# Altium schematic sheet PowerSupply.SchDoc
size A4; Author: Esteban Durán Madrid; CompanyName: Universidad de Santiago de Chile; Address1: Avenida Ecuador Nº 3519; Address2: Estación Central, Santiago; Address3: Chile; DocumentNumber: 2; SheetNumber: 2; SheetTotal: 3
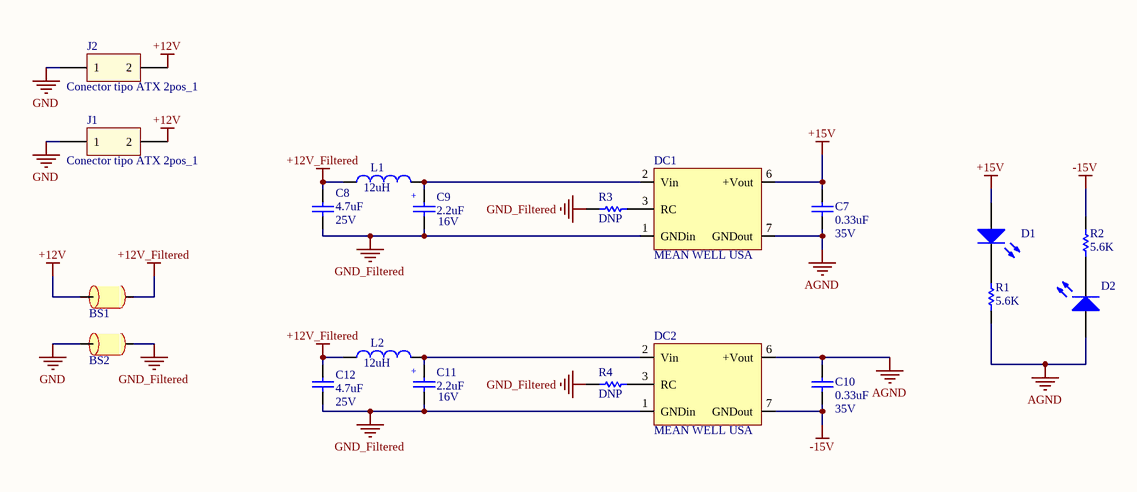
[diagram p0: PowerSupply.SchDoc]

## Parts
BS1  Ferrite bead  [RES_1206]  (value not drawn)
BS2  Ferrite bead  [RES_1206]  (value not drawn)
C7  0.33uF  Voltage: 35V  [CAP_0603]
C8  4.7uF  Voltage: 25V  [CAP_0805]
C9  2.2uF  Voltage: 16V  [CAP_1206 Tantalio]
C10  0.33uF  Voltage: 35V  [CAP_0603]
C11  2.2uF  Voltage: 16V  [CAP_1206 Tantalio]
C12  4.7uF  Voltage: 25V  [CAP_0805]
D1  LED  [LED_0805_GREEN]  (value not drawn)
D2  LED  [LED_0805_GREEN]  (value not drawn)
DC1  MEAN WELL USA  [DC/DC 15V 5W]
DC2  MEAN WELL USA  [DC/DC 15V 5W]
J1  Conector tipo ATX 2pos_1  [Conector tipo ATX Wurth 2 posiciones - (5.5mm)]
J2  Conector tipo ATX 2pos_1  [Conector tipo ATX Wurth 2 posiciones - (5.5mm)]
L1  12uH  [INDUCTOR_0805]
L2  12uH  [INDUCTOR_0805]
R1  5.6K  [RES_0805]
R2  5.6K  [RES_0805]
R3  DNP  [RES_0603]
R4  DNP  [RES_0603]

## Nets
+12V: BS1.1 J1.2 J2.2
+12V_Filtered: BS1.2 C8.1 C12.1 L1.1 L2.1
+15V: C7.1 D1.1(A) DC1.6(+Vout)
-15V: C10.2 DC2.7(GNDout) R2.2
AGND: C7.2 C10.1 D2.1(A) DC1.7(GNDout) DC2.6(+Vout) R1.1
GND: BS2.1 J1.1 J2.1
GND_Filtered: BS2.2 C8.2 C9.2 C11.2 C12.2 DC1.1(GNDin) DC2.1(GNDin) R3.2 R4.2
NetC9_1: C9.1 DC1.2(Vin) L1.2
NetC11_1: C11.1 DC2.2(Vin) L2.2
NetD1_2: D1.2(K) R1.2
NetD2_2: D2.2(K) R2.1
NetDC1_3: DC1.3(RC) R3.1
NetDC2_3: DC2.3(RC) R4.1

Not connected (* = marked no-connect by the designer): DC1 15(NC) 16(NC) 17(NC) 26(NC) 27(NC); DC2 15(NC) 16(NC) 17(NC) 26(NC) 27(NC)

## Notes on the sheet
- Title
- Size:
- Date:
- A4
- Revision:
- Time:
- Sheet
- of
- Author:
- Project:
- (in symbol Cap Tantalio 1206) +

## Library data of the parts
BS1 BS2 = Bead: 4A; Manufacturer Part-Number: FBMJ3216HM600-T; Digikey Part-Number: 587-1770-1-ND
C7 C10 = Cap_0603: Capacitor Ceramic; Manufacturer Part-Number: CGA3E1X7R1V334K080AD; Digikey Part-Number: 445-9821-1-ND; Value: 0.33uF
C8 C12 = Cap_0805: Capacitor; Manufacturer Part-Number: CL21A475KAQNNNE; Digikey Part-Number: 1276-1244-1-ND; Value: 4.7uF
C9 C11 = Cap Tantalio 1206: Capacitor Tantalio; Manufacturer Part-Number: 293D225X9016A2TE3; Digikey Part-Number: 718-1131-1-ND; Value: 2.2uF
D1 = LED2: LED azul; Manufacturer Part-Number: 150080BS75000; Published: 8-Jun-2000; LatestRevisionDate: 17-Jul-2002; LatestRevisionNote: Re-released for DXP Platform.; PackageDocument: Feb-2002; PackageReference: 3.2X1.6X1.1; Publisher: Altium Limited; Digikey Part-Number: 732-4982-1-ND
D2 = LED2: LED Azul; Manufacturer Part-Number: 150080BS75000; Published: 8-Jun-2000; LatestRevisionDate: 17-Jul-2002; LatestRevisionNote: Re-released for DXP Platform.; PackageDocument: Feb-2002; PackageReference: 3.2X1.6X1.1; Publisher: Altium Limited; Digikey Part-Number: 732-4982-1-ND
DC1 DC2 = DC/DC +12V a +15V 5W: Isolated Module DC DC Converter 1 Output 15V 333mA 9V - 18V Input; Manufacturer Part-Number: SPB05A-15; Digikey Part-Number: 1866-4794-ND
J1 J2 = Conector tipo ATX 2pos_1: CONN HEADER VERT 2POS 5.5MM; Manufacturer Part-Number: 64900221122; Digikey Part-Number: 732-1927-ND
L1 L2 = Inductor_0805: 200mA; Manufacturer Part-Number: LBM2016T120J; Digikey Part-Number: 587-3089-1-ND; Value: 12uH
R1 R2 = Res0805: Manufacturer Part-Number: ERJ-P06J562V; Published: 8-Jun-2000; LatestRevisionDate: 17-Jul-2002; LatestRevisionNote: Re-released for DXP Platform.; PackageReference: AXIAL-0.3; Publisher: Altium Limited; PackageDescription: Axial Device, Thru-Hole; 2 Leads; 0.3 in Pin Spacing; Digikey Part-Number: P5.6KADCT-ND; Value: 5.6K
R3 R4 = Res0603: Manufacturer Part-Number: RMCF0603ZT0R00; Value: 0; Digikey Part-Number: RMCF0603ZT0R00CT-ND